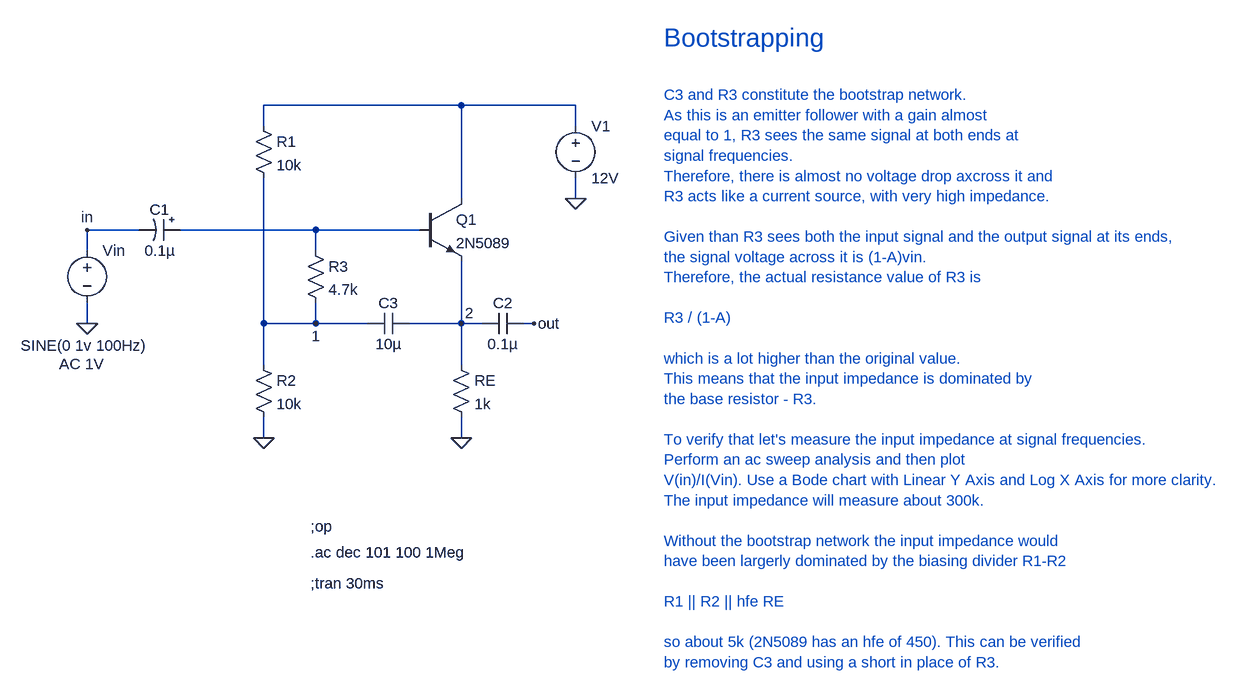
[diagram p0: schematic Figure2.65.asc]
Figure2.65.asc, the LTspice schematic file:
Version 4
SHEET 1 3200 1108
WIRE 432 -64 128 -64
WIRE 608 -64 432 -64
WIRE 128 -32 128 -64
WIRE 608 -32 608 -64
WIRE 432 80 432 -64
WIRE 608 80 608 48
WIRE -64 128 -144 128
WIRE 208 128 0 128
WIRE 368 128 208 128
WIRE -144 160 -144 128
WIRE 208 160 208 128
WIRE -144 272 -144 240
WIRE 128 272 128 48
WIRE 208 272 208 240
WIRE 208 272 128 272
WIRE 288 272 208 272
WIRE 432 272 432 176
WIRE 432 272 352 272
WIRE 464 272 432 272
WIRE 544 272 528 272
WIRE 128 336 128 272
WIRE 432 336 432 272
WIRE 128 448 128 416
WIRE 432 448 432 416
FLAG 608 80 0
FLAG 432 448 0
FLAG 128 448 0
FLAG -144 272 0
FLAG 544 272 out
FLAG -144 128 in
FLAG 208 272 1
FLAG 432 272 2
SYMBOL res 112 -48 R0
SYMATTR InstName R1
SYMATTR Value 10k
SYMBOL res 112 320 R0
SYMATTR InstName R2
SYMATTR Value 10k
SYMBOL res 416 320 R0
SYMATTR InstName RE
SYMATTR Value 1k
SYMBOL voltage 608 -48 R0
WINDOW 123 0 0 Left 0
WINDOW 39 0 0 Left 0
SYMATTR InstName V1
SYMATTR Value 12V
SYMBOL npn 368 80 R0
SYMATTR InstName Q1
SYMATTR Value 2N5089
SYMBOL voltage -144 144 R0
WINDOW 123 -43 190 Left 2
WINDOW 39 0 0 Left 0
WINDOW 3 -102 162 Left 2
SYMATTR Value2 AC 1V
SYMATTR Value SINE(0 1v 100Hz)
SYMATTR InstName Vin
SYMBOL polcap 0 112 R90
WINDOW 0 0 32 VBottom 2
WINDOW 3 32 32 VTop 2
SYMATTR InstName C1
SYMATTR Value 0.1µ
SYMBOL cap 528 256 R90
WINDOW 0 0 32 VBottom 2
WINDOW 3 32 32 VTop 2
SYMATTR InstName C2
SYMATTR Value 0.1µ
SYMBOL res 192 144 R0
SYMATTR InstName R3
SYMATTR Value 4.7k
SYMBOL cap 352 256 R90
WINDOW 0 0 32 VBottom 2
WINDOW 3 32 32 VTop 2
SYMATTR InstName C3
SYMATTR Value 10µ
TEXT 200 584 Left 2 !;op
TEXT 200 624 Left 2 !.ac dec 101 100 1Meg
TEXT 744 -80 Left 2 ;C3 and R3 constitute the bootstrap network.\nAs this is an emitter follower with a gain almost \nequal to 1, R3 sees the same signal at both ends at \nsignal frequencies.\nTherefore, there is almost no voltage drop axcross it and \nR3 acts like a current source, with very high impedance.\n \nGiven than R3 sees both the input signal and the output signal at its ends,\nthe signal voltage across it is (1-A)vin.\nTherefore, the actual resistance value of R3 is\n \nR3 / (1-A)\n \nwhich is a lot higher than the original value.\nThis means that the input impedance is dominated by\nthe base resistor - R3.\n \nTo verify that let's measure the input impedance at signal frequencies. \nPerform an ac sweep analysis and then plot \nV(in)/I(Vin). Use a Bode chart with Linear Y Axis and Log X Axis for more clarity.\nThe input impedance will measure about 300k.\n \nWithout the bootstrap network the input impedance would\nhave been largerly dominated by the biasing divider R1-R2\n \nR1 || R2 || hfe RE\n \nso about 5k (2N5089 has an hfe of 450). This can be verified \nby removing C3 and using a short in place of R3.
TEXT 744 -168 Left 4 ;Bootstrapping
TEXT 200 672 Left 2 !;tran 30ms

The netlist it stands for:
* Figure2.65.asc
R1 N001 1 10k
R2 1 0 10k
RE 2 0 1k
V1 N001 0 12V
Q1 N001 N002 2 0 2N5089
Vin in 0 SINE(0 1v 100Hz) AC 1V
C1 N002 in 0.1µ
C2 out 2 0.1µ
R3 N002 1 4.7k
C3 2 1 10µ
.model NPN NPN
.model PNP PNP
.lib standard.bjt
;op
.ac dec 101 100 1Meg
* C3 and R3 constitute the bootstrap network.
* As this is an emitter follower with a gain almost
* equal to 1, R3 sees the same signal at both ends at
* signal frequencies.
* Therefore, there is almost no voltage drop axcross it and
* R3 acts like a current source, with very high impedance.
* Given than R3 sees both the input signal and the output signal at its ends,
* the signal voltage across it is (1-A)vin.
* Therefore, the actual resistance value of R3 is
* R3 / (1-A)
* which is a lot higher than the original value.
* This means that the input impedance is dominated by
* the base resistor - R3.
* To verify that let's measure the input impedance at signal frequencies.
* Perform an ac sweep analysis and then plot
* V(in)/I(Vin). Use a Bode chart with Linear Y Axis and Log X Axis for more clarity.
* The input impedance will measure about 300k.
* Without the bootstrap network the input impedance would
* have been largerly dominated by the biasing divider R1-R2
* R1 || R2 || hfe RE
* so about 5k (2N5089 has an hfe of 450). This can be verified
* by removing C3 and using a short in place of R3.
* Bootstrapping
;tran 30ms
.backanno
.end